# EAGLE board robot_board (EAGLE 7.2.0), part 1 of 2
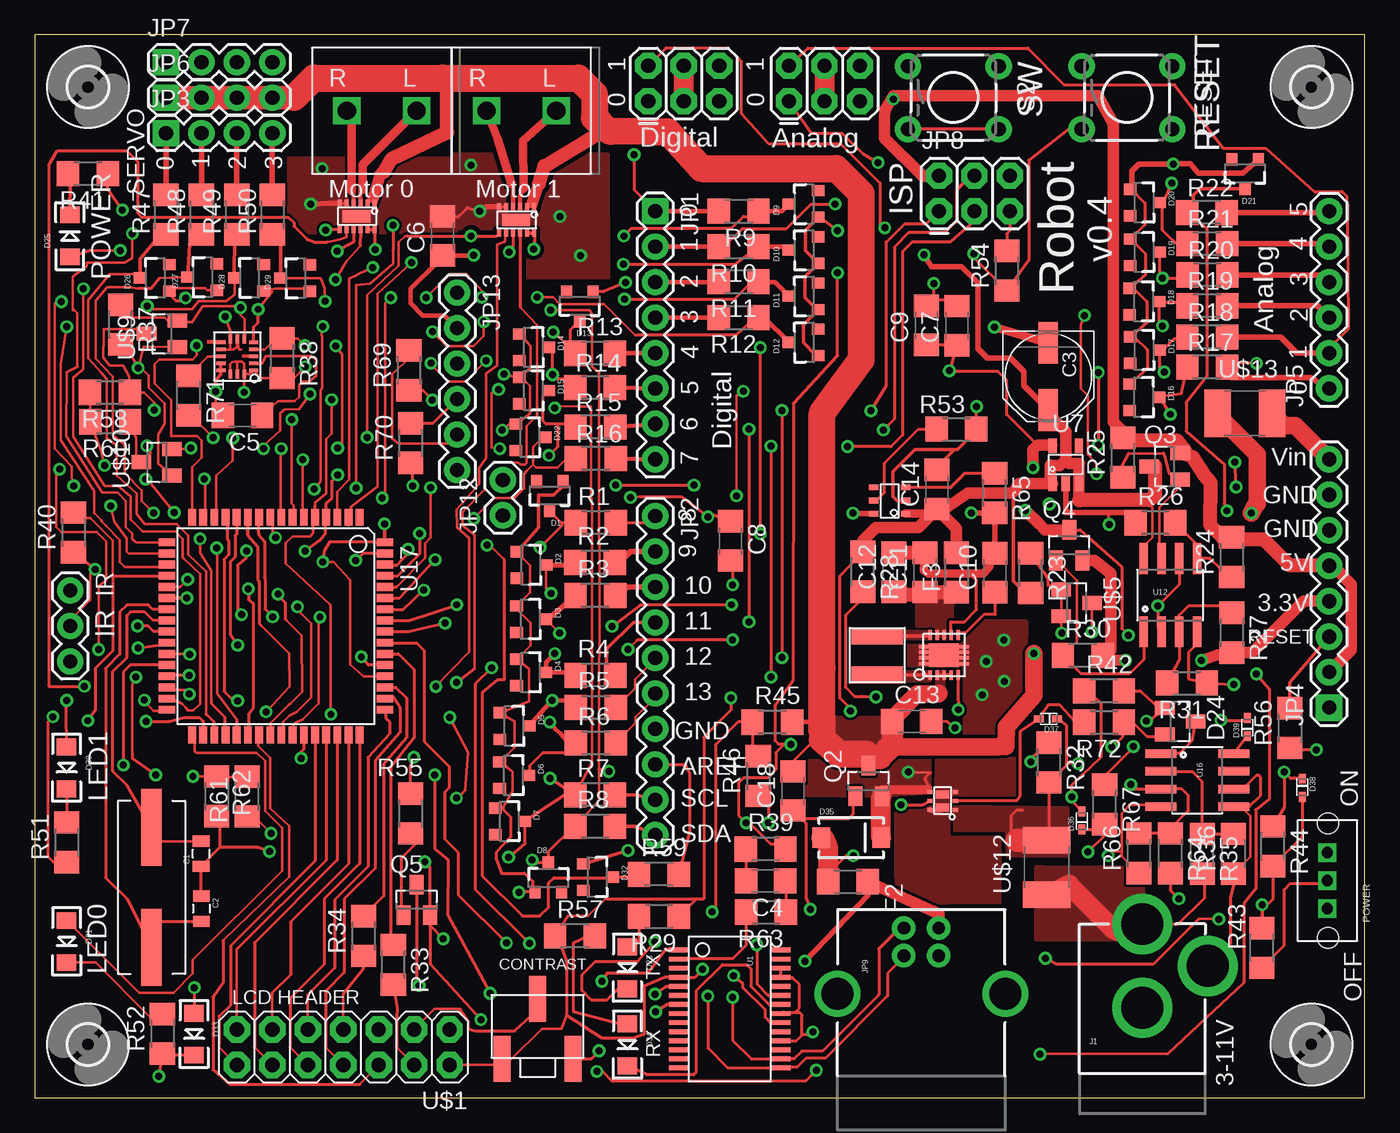
[diagram p1: board, top side]
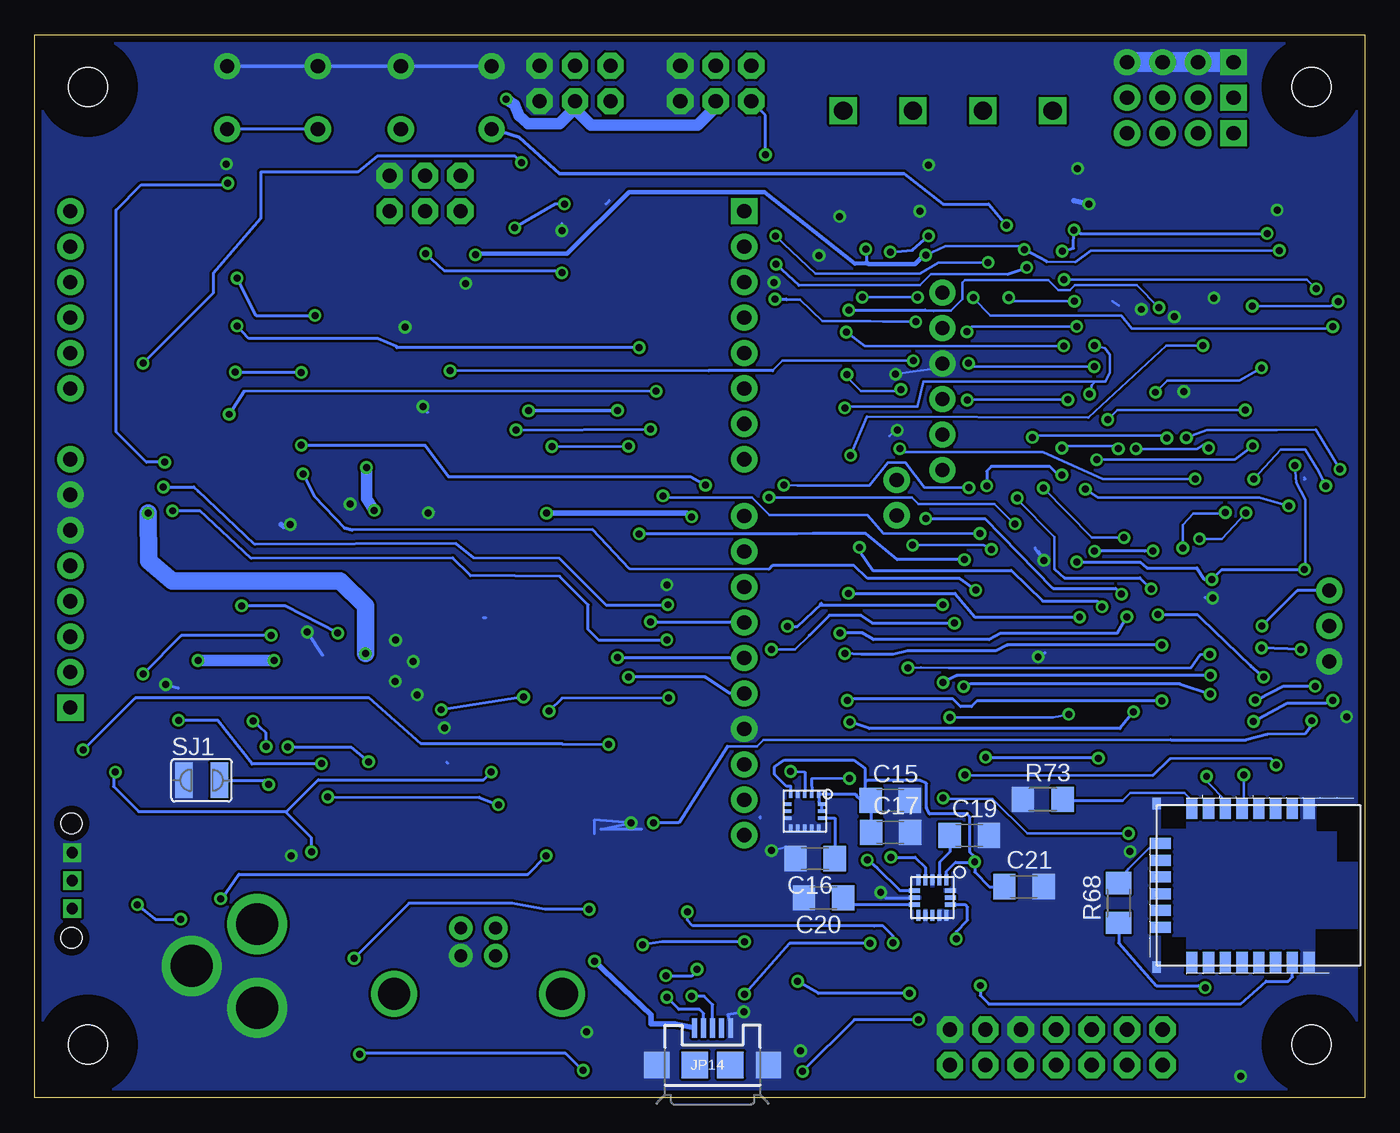
[diagram p2: board, bottom side, seen from below]

Size 95.24 x 76.12 mm. Coordinates in mm from the lower left corner, seen from the top.
Outline: 95.24,0 95.24,76.12 0,76.12 0,0 95.24,0
Copper layers (1*16): Top 0.035mm / dielectric 1.5mm / Bottom 0.035mm
Design rules "default *": minimum track width 7mil, minimum drill 19mil, track to track 7mil, track to pad 8mil, pad to pad 8mil, via to via 8mil, smd to smd 1mil, copper to edge 20mil, drill to drill 8mil, minimum pad ring 10mil, minimum via ring 8mil, stop-mask expansion 4mil, vias tented up to drill 0mil, thermal gap 10mil
bRestrict: area 0.3,16.9 to 1.9,19.1; area 0.3,19.1 to 3.4,21; area 0.2,9.4 to 3.5,12; area 12.8,19.3 to 14.5,21; area 12.8,9.4 to 14.5,11.4; area 30.2,13.6 to 31.7,15

## Footprints (pad centres in the part's own frame; a part is rotated, then mirrored left to right if it is on the bottom)
0805 = smd 0.8 x 1.2: 1 -0.9,0; 2 0.9,0
PANASONIC_D = smd 3 x 1.4: + 2.4,0; - -2.4,0
C1206 = smd 1.6 x 1.8: 1 -1.4,0; 2 1.4,0
SOT23-3 = smd 0.8 x 0.9: 1 -0.95,-1; 2 0.95,-1; 3 0,1.1
LED-1206 = smd 1.2 x 1.4: A -1.5,0; C 1.5,0
SOT23 = smd 1 x 1.4: 1 -0.95,-1.1; 2 0.95,-1.1; 3 0,1.1
SMA-DIODE = smd 1.27 x 1.47: A -2.15,0; C 2.15,0
SOD523 = smd 0.7 x 0.5: A 0.7,0; C -0.6,0
R1206 = smd 1.6 x 1.803: 1 -1.422,0; 2 1.422,0
2,8 = hole 2.8: 0,0
1X03 = drill 1.016 pad 1.88: 1 0,0; 2 2.54,0; 3 5.08,0
POWER_JACK_PTH = drill 2.997 pad 4.318: GND 0,7.7; GNDBREAK 4.7,10.7; PWR 0,13.7
1X08 = drill 1.016 pad 1.88 square: 1 0,0 | drill 1.016 pad 1.88: 2 2.54,0; 3 5.08,0; 4 7.62,0; 5 10.16,0; 6 12.7,0; 7 15.24,0; 8 17.78,0
1X10 = drill 1.016 pad 1.88: 1 0,0; 2 2.54,0; 3 5.08,0; 4 7.62,0; 5 10.16,0; 6 12.7,0; 7 15.24,0; 8 17.78,0; 9 20.32,0; 10 22.86,0
1X04 = drill 1.016 pad 1.88 square: 1 0,0 | drill 1.016 pad 1.88: 2 2.54,0; 3 5.08,0; 4 7.62,0
1X06 = drill 1.016 pad 1.88: 1 0,0; 2 2.54,0; 3 5.08,0; 4 7.62,0; 5 10.16,0; 6 12.7,0
2X3 = drill 1.016 pad 1.88 octagon: 1 0,0; 2 0,2.54; 3 2.54,0; 4 2.54,2.54; 5 5.08,0; 6 5.08,2.54
USB-B-PTH = drill 0.914 pad 1.676: D+ 0,1.25; D- 1.981,1.25; GND 0,-1.25; VBUS 1.981,-1.25 | drill 2.286: S1 -2.718,-6.02; S2 -2.718,6.02
1X02 = drill 1.016 pad 1.88: 1 0,0; 2 2.54,0
USB-MICROB = smd 0.35 x 1.4: D+ 0,2.65; D- -0.65,2.65; GND 1.3,2.65; ID 0.65,2.65; VBUS -1.3,2.65 | smd 1.8 x 1.9: MT1 -4,0; MT2 4,0 | smd 1.9 x 1.9: P$1 -1.27,0; P$2 1.27,0
SW = drill 0.8 square: P$1 0,0; P$2 2,0; P$3 -2,0 | hole 1.5: -4.1,-0.04; 4.1,-0.04
TACTILE-PTH = drill 1.016 pad 1.88: 1 -3.251,2.261; 2 3.251,2.261; 3 -3.251,-2.261; 4 3.251,-2.261
SJW = smd 1.27 x 2.54: 1 -1.27,0; 2 1.27,0
SSOP28DB = smd 0.348 x 1.397: 1 -4.225,-3.656; 2 -3.575,-3.656; 3 -2.925,-3.656; 4 -2.275,-3.656; 5 -1.625,-3.656; 6 -0.975,-3.656; 7 -0.325,-3.656; 8 0.325,-3.656; 9 0.975,-3.656; 10 1.625,-3.656; 11 2.275,-3.656; 12 2.925,-3.656; 13 3.575,-3.656; 14 4.225,-3.656; 15 4.225,3.656; 16 3.575,3.656; 17 2.925,3.656; 18 2.275,3.656; 19 1.625,3.656; 20 0.975,3.656; 21 0.325,3.656; 22 -0.325,3.656; 23 -0.975,3.656; 24 -1.625,3.656; 25 -2.275,3.656; 26 -2.925,3.656; 27 -3.575,3.656; 28 -4.225,3.656
SOT-23-5 = smd 1.05 x 0.6: P$1 0.53,2.24; P$2 0.53,1.29; P$3 0.53,0.34; P$4 3.23,2.24; P$5 3.23,0.35
SOT23-M5 = smd 0.4 x 0.7: P$1 -0.62,-0.35; P$2 0.33,-0.35; P$3 1.28,-0.35; P$4 1.28,1.94; P$5 0.33,1.94; P$6 -0.62,1.94
PWSON-N12 = smd 2 x 0.9: GND 0.82,0.63 | smd 0.28 x 0.5: P$1 -0.46,-0.32; P$2 0.04,-0.32; P$3 0.54,-0.32; P$4 1.04,-0.32; P$5 1.54,-0.32; P$6 2.04,-0.32; P$7 -0.46,1.58; P$8 0.04,1.58; P$9 0.54,1.58; P$10 1.04,1.58; P$11 1.54,1.58; P$12 2.04,1.58
SO08 = smd 0.61 x 2.21: 1 -1.905,-2.616; 2 -0.635,-2.616; 3 0.635,-2.616; 4 1.905,-2.616; 5 1.905,2.616; 6 0.635,2.616; 7 -0.635,2.616; 8 -1.905,2.616
TQFP64 = smd 1.194 x 0.559: 1 -7.8,6; 2 -7.8,5.2; 3 -7.8,4.4; 4 -7.8,3.6; 5 -7.8,2.8; 6 -7.8,2; 7 -7.8,1.2; 8 -7.8,0.4; 9 -7.8,-0.4; 10 -7.8,-1.2; 11 -7.8,-2; 12 -7.8,-2.8; 13 -7.8,-3.6; 14 -7.8,-4.4; 15 -7.8,-5.2; 16 -7.8,-6; 33 7.8,-6; 34 7.8,-5.2; 35 7.8,-4.4; 36 7.8,-3.6; 37 7.8,-2.8; 38 7.8,-2; 39 7.8,-1.2; 40 7.8,-0.4; 41 7.8,0.4; 42 7.8,1.2; 43 7.8,2; 44 7.8,2.8; 45 7.8,3.6; 46 7.8,4.4; 47 7.8,5.2; 48 7.8,6 | smd 0.559 x 1.194: 17 -6,-7.8; 18 -5.2,-7.8; 19 -4.4,-7.8; 20 -3.6,-7.8; 21 -2.8,-7.8; 22 -2,-7.8; 23 -1.2,-7.8; 24 -0.4,-7.8; 25 0.4,-7.8; 26 1.2,-7.8; 27 2,-7.8; 28 2.8,-7.8; 29 3.6,-7.8; 30 4.4,-7.8; 31 5.2,-7.8; 32 6,-7.8; 49 6,7.8; 50 5.2,7.8; 51 4.4,7.8; 52 3.6,7.8; 53 2.8,7.8; 54 2,7.8; 55 1.2,7.8; 56 0.4,7.8; 57 -0.4,7.8; 58 -1.2,7.8; 59 -2,7.8; 60 -2.8,7.8; 61 -3.6,7.8; 62 -4.4,7.8; 63 -5.2,7.8; 64 -6,7.8
2X7 = drill 1.016 pad 1.88 octagon: 1 0,0; 2 0,2.54; 3 2.54,0; 4 2.54,2.54; 5 5.08,0; 6 5.08,2.54; 7 7.62,0; 8 7.62,2.54; 9 10.16,0; 10 10.16,2.54; 11 12.7,0; 12 12.7,2.54; 13 15.24,0; 14 15.24,2.54
POT = smd 1.194 x 3.302: 1 -2.54,0; 2 0,4.318; 3 2.54,0
WSON-10 = smd 0.7 x 0.25: GND@N1 -1.43,0.6; GND@N2 -1.43,0.2; GND@N3 -1.43,-0.2; GND@N4 -1.43,-0.6; GND@N5 1.43,0.6; GND@N6 1.43,0.2; GND@N7 1.43,-0.2; GND@N8 1.43,-0.6 | smd 0.25 x 0.7: P$1 -1,-1.44; P$2 -0.5,-1.44; P$3 0,-1.44; P$4 0.5,-1.44; P$5 1,-1.43; P$6 1,1.44; P$7 0.5,1.44; P$8 0,1.44; P$9 -0.5,1.44; P$10 -1,1.44 | smd 2.16 x 1.7: P$11 0,0
TAIYO4012 = smd 1.2 x 3.7: P$1 1.4,0; P$2 -1.4,0
SC70T = smd 0.3 x 0.35: D1@1 -0.65,0.89; D2@1 0.65,-0.94; G1 0,-0.94; G2 0,0.89; S1 -0.65,-0.94; S2 0.65,0.89 | smd 0.6 x 0.95: D1@2 -0.47,-0.02; D2@2 0.46,-0.02
RN4020_PKG = smd 1.5 x 0.8: P$1 0.25,10.9; P$2 0.25,9.7; P$3 0.25,8.5; P$4 0.25,7.3; P$5 0.25,6.1; P$6 0.25,4.9; P$7 0.25,3.7; P$8 0.25,2.5; P$15 11.25,2.5; P$16 11.25,3.7; P$17 11.25,4.9; P$18 11.25,6.1; P$19 11.25,7.3; P$20 11.25,8.5; P$21 11.25,9.7; P$22 11.25,10.9 | smd 0.8 x 1.5: P$9 2.75,0.25; P$10 3.95,0.25; P$11 5.15,0.25; P$12 6.35,0.25; P$13 7.55,0.25; P$14 8.75,0.25 | smd 0.8 x 0.635: P$23 -0.1,-0.02; P$24 11.6,-0.02
QFN-COL = smd 0.67 x 0.25: P$1 -1.17,0.99; P$2 -1.17,0.49; P$3 -1.17,-0.01; P$4 -1.17,-0.51; P$5 -1.17,-1.01; P$9 1.17,-1; P$10 1.17,-0.5; P$11 1.17,0; P$12 1.17,0.5; P$13 1.17,1 | smd 0.25 x 0.67: P$6 -0.5,-1.26; P$7 0,-1.26; P$8 0.5,-1.26; P$14 0.5,1.26; P$15 0,1.26; P$16 -0.5,1.26
LGA-16 = smd 0.5 x 0.25: P$1 -1.19,1; P$2 -1.19,0.5; P$3 -1.19,0; P$4 -1.19,-0.5; P$5 -1.19,-1; P$9 1.19,-1; P$10 1.19,-0.5; P$11 1.19,0; P$12 1.19,0.5; P$13 1.19,1 | smd 0.25 x 0.5: P$6 -0.5,-1.19; P$7 0,-1.19; P$8 0.5,-1.19; P$14 0.5,1.19; P$15 0,1.19; P$16 -0.5,1.19
C1812 = smd 1.9 x 3.4: 1 -1.95,0; 2 1.95,0
FSOS8700CQ_PKG = smd 0.8 x 0.3: P$1 -1.28,1; P$2 -1.28,0.5; P$3 -1.28,0; P$4 -1.28,-0.5; P$5 -1.28,-1; P$9 1.28,-1; P$10 1.28,-0.5; P$11 1.28,0; P$12 1.28,0.5; P$13 1.28,1 | smd 0.3 x 0.8: P$6 -0.5,-1.28; P$7 0,-1.28; P$8 0.5,-1.28; P$14 0.5,1.28; P$15 0,1.28; P$16 -0.5,1.28
2POS_TERMINAL = drill 1.3 square: L -5,0; R 0,0
CRYSTAL-SMD-10.5X4.8-2PIN = smd 5.5 x 1.5: P$1 -4.3,0; P$2 4.3,0

## Placement (x,y rotation side)
C1  22pF  [0805]  11.9,17.48 90 top
C2  22pF  [0805]  11.93,13.54 270 top
C3  100uF  [PANASONIC_D]  72.58,51.66 270 top
C4  .1uF  [C1206]  52.34,15.52 180 top
C5  .1uF  [C1206]  14.87,48.87 180 top
C6  .1uF  [C1206]  29.2,61.72 90 top
C7  22uF  [C1206]  66.03,55.3 90 top
C8  .1uF  [C1206]  49.82,39.88 270 top
C9  1uF  [C1206]  63.85,55.32 90 top
C10  .1uF  [C1206]  68.75,37.59 90 top
C11  22uF  [C1206]  63.74,37.62 90 top
C12  22uF  [C1206]  61.53,37.64 90 top
C13  22uF  [C1206]  62.8,26.95 0 top
C14  1uF  [C1206]  64.61,43.56 90 top
C15  .1uF  [C1206]  33.98,21.29 0 bottom
C16  .01uF (25V)  [C1206]  39.36,17.12 180 bottom
C17  10uF  [C1206]  33.95,19 0 bottom
C18  .1uF  [C1206]  54.3,21.97 90 top
C19  .1uF  [C1206]  28.31,18.8 0 bottom
C20  .1uF  [C1206]  38.75,14.3 180 bottom
C21  .1uF  [C1206]  24.4,15.11 0 bottom
D1  5.1V  [SOT23-3]  36.87,43.13 180 top
D2  5.1V  [SOT23-3]  35.52,38.15 270 top
D3  5.1V  [SOT23-3]  35.5,34.26 270 top
D4  5.1V  [SOT23-3]  35.5,30.45 270 top
D5  5.1V  [SOT23-3]  34.31,26.62 270 top
D6  5.1V  [SOT23-3]  34.28,23.09 270 top
D7  3.6V  [SOT23-3]  33.98,19.79 270 top
D8  3.6V  [SOT23-3]  36.77,15.72 0 top
D9  5.1V  [SOT23-3]  55.11,64.01 90 top
D10  5.1V  [SOT23-3]  55.11,60.71 90 top
D11  5.1V  [SOT23-3]  55.11,57.4 90 top
D12  5.1V  [SOT23-3]  55.11,54.1 90 top
D13  5.1V  [SOT23-3]  39.03,56.72 180 top
D14  5.1V  [SOT23-3]  35.7,53.75 270 top
D15  5.1V  [SOT23-3]  35.7,50.65 270 top
D16  5.1V  [SOT23-3]  79.42,50.16 270 top
D17  5.1V  [SOT23-3]  79.44,53.54 270 top
D18  5.1V  [SOT23-3]  79.42,57.02 270 top
D19  5.1V  [SOT23-3]  79.44,60.55 270 top
D20  5.1V  [SOT23-3]  79.44,64.11 270 top
D21  5.1V  [SOT23-3]  86.68,66.19 180 top
D22  5.1V  [SOT23-3]  35.45,47.29 270 top
D23  YELLOW  [LED-1206]  42.43,9.3 270 top
D24  BAT54C  [SOT23]  82.03,26.95 270 top
D25  RED  [LED-1206]  2.5,61.72 90 top
D26  5.1V  [SOT23-3]  8.63,58.72 90 top
D27  5.1V  [SOT23-3]  12.03,58.78 90 top
D28  5.1V  [SOT23-3]  15.38,58.72 90 top
D29  5.1V  [SOT23-3]  18.68,58.7 90 top
D30  GREEN  [LED-1206]  2.28,23.62 270 top
D31  YELLOW  [LED-1206]  2.28,11.18 270 top
D32  5.1V  [SOT23-3]  40.27,15.8 270 top
D33  YELLOW  [LED-1206]  11.39,4.55 270 top
D34  YELLOW  [LED-1206]  42.43,3.78 270 top
D35  STPS2L40U  [SMA-DIODE]  58.46,18.62 0 top
D36  BZX584C10-V-G-08  [SOD523]  75,19.81 90 top
D37  BZX584C10-V-G-08  [SOD523]  72.61,27.13 180 top
D38  BZX584C10-V-G-08  [SOD523]  90.77,22.25 270 top
D39  RB751S40T1G  [SOD523]  86.83,26.49 90 top
F2  1206PPTC_FUSE  [R1206]  58.23,15.47 180 top
F3  1206PPTC_FUSE  [R1206]  66,37.62 90 top
H1  MOUNT-HOLE2.8  [2,8]  3.8,3.81 90 top
H2  MOUNT-HOLE2.8  [2,8]  3.8,72.39 90 top
H3  MOUNT-HOLE2.8  [2,8]  91.43,3.81 90 top
H4  MOUNT-HOLE2.8  [2,8]  91.43,72.39 90 top
IR  [1X03]  2.53,36.32 270 top
J1  POWER_JACKPTH  [POWER_JACK_PTH]  79.31,-1.27 0 top
JP1  [1X08]  44.44,63.5 270 top
JP2  M10"  [1X10]  44.44,41.66 270 top
JP3  [1X04]  9.39,69.09 0 top
JP4  [1X08]  92.7,27.94 90 top
JP5  [1X06]  92.7,50.8 90 top
JP6  [1X04]  9.39,71.63 0 top
JP7  [1X04]  9.39,74.17 0 top
JP8  [2X3]  64.76,63.5 0 top
JP9  USB-B  [USB-B-PTH]  63.49,10.16 90 top
JP10  [2X3]  54.02,71.37 0 top
JP11  [2X3]  43.93,71.37 0 top
JP12  M02PTH  [1X02]  33.52,41.71 90 top
JP13  Bluesmirf  [1X06]  30.24,57.66 270 top
JP14  USB-MICROB  [USB-MICROB]  46.7,2.34 0 bottom
POWER  SW  [SW]  92.57,15.54 90 top
Q2  SSM3J332R  [SOT23]  59.71,22.68 0 top
Q3  IRLML6402  [SOT23]  80.91,45.21 90 top
Q4  IRLML6402  [SOT23]  74.08,39.57 0 top
Q5  IRLML6402  [SOT23]  27.35,14.17 0 top
R1  300  [R1206]  40.17,41.17 0 top
R2  300  [R1206]  40.12,38.33 0 top
R3  300  [R1206]  40.15,35.97 0 top
R4  300  [R1206]  40.15,30.25 0 top
R5  300  [R1206]  40.17,27.94 0 top
R6  300  [R1206]  40.17,25.4 0 top
R7  300  [R1206]  40.12,21.69 0 top
R8  300  [R1206]  40.12,19.43 0 top
R9  300  [R1206]  50.41,63.5 180 top
R10  300  [R1206]  50.41,60.96 180 top
R11  300  [R1206]  50.41,58.45 180 top
R12  300  [R1206]  50.41,55.88 180 top
R13  300  [R1206]  40.12,53.31 0 top
R14  300  [R1206]  40.12,50.85 0 top
R15  300  [R1206]  40.15,48.03 0 top
R16  300  [R1206]  40.17,45.77 0 top
R17  300  [R1206]  83.96,52.32 0 top
R18  300  [R1206]  83.96,54.48 0 top
R19  300  [R1206]  83.96,56.72 0 top
R20  300  [R1206]  83.99,58.93 0 top
R21  300  [R1206]  83.96,61.16 0 top
R22  300  [R1206]  83.94,63.4 0 top
R23  1K 1%  [R1206]  71.31,37.57 270 top
R24  24K 1%  [R1206]  85.71,38.71 90 top
R25  20K 1%  [R1206]  77.92,45.85 90 top
R26  20K 1%  [R1206]  80.25,41.17 0 top
R27  10K 1%  [R1206]  85.74,33.3 270 top
R28  1M  [R1206]  59.3,37.67 270 top
R29  330  [R1206]  44.69,12.98 180 top
R30  20K 1%  [R1206]  75.05,31.67 0 top
R31  24K 1%  [R1206]  82.51,29.69 180 top
R32  10K 1%  [R1206]  72.63,24 270 top
R33  300  [R1206]  25.67,9.53 270 top
R34  300  [R1206]  23.54,11.58 90 top
R35  100K 1%  [R1206]  83.61,17.48 270 top
R36  10K 1%  [R1206]  85.84,17.48 90 top
R37  10K 1%  [R1206]  6.14,55.37 270 top
R38  10K 1%  [R1206]  17.72,52.96 270 top
R39  1K 1%  [R1206]  52.34,17.81 0 top
R40  10K 1%  [R1206]  2.76,40.49 90 top
R41  560  [R1206]  3.8,66.19 180 top
R42  560  [R1206]  76.57,29.13 0 top
R43  4.7K 1%  [R1206]  87.87,10.72 270 top
R44  100K 1%  [R1206]  88.66,18.01 270 top
R45  120K 1%  [R1206]  52.82,26.9 0 top
R46  100K 1%  [R1206]  51.81,23.04 90 top
R47  300  [R1206]  9.39,63.25 90 top
R48  300  [R1206]  11.93,63.25 90 top
R49  300  [R1206]  14.47,63.25 90 top
R50  300  [R1206]  17.01,63.25 90 top
R51  330  [R1206]  2.28,18.29 90 top
R52  330  [R1206]  9.13,4.57 90 top
R53  1.5K 1%  [R1206]  66,47.88 180 top
R54  1K 1%  [R1206]  69.61,59.23 90 top
R55  1K 1%  [R1206]  26.91,20.35 90 top
R56  1K 1%  [R1206]  89.88,26.47 90 top
R57  330  [R1206]  38.67,11.58 0 top
R58  10K 1%  [R1206]  5.37,50.52 180 top
R59  1K 1%  [R1206]  44.69,16 0 top
R60  10K 1%  [R1206]  5.4,48.41 180 top
R61  1K 1%  [R1206]  15.2,21.56 270 top
R62  2K  [R1206]  13.02,21.59 90 top
R63  300  [R1206]  52.36,13.28 180 top
R64  120K 1%  [R1206]  81.32,17.5 270 top
R65  1K 1%  [R1206]  68.75,43.31 270 top
R66  120K 1%  [R1206]  79.06,17.5 90 top
R67  10K 1%  [R1206]  76.62,21.01 270 top
R68  300  [R1206]  17.62,13.94 90 bottom
R69  300  [R1206]  26.79,52.1 90 top
R70  300  [R1206]  26.91,46.89 90 top
R71  1K 1%  [R1206]  11.01,50.29 270 top
R72  560  [R1206]  76.57,26.9 180 top
R73  1K 1%  [R1206]  23.05,21.36 0 bottom
RESET  [TACTILE-PTH]  78.22,71.63 0 top
S2  [TACTILE-PTH]  65.78,71.63 0 top
SJ1  [SJW]  83.3,22.73 0 bottom
U1  FT232RL-BASICSSOP  [SSOP28DB]  49.77,6.35 270 top
U7  TLV70233  [SOT-23-5]  75.12,43.46 90 top
U8  MIC2009A  [SOT23-M5]  62.02,42.44 90 top
U9  DRV8839  [PWSON-N12]  35.3,63.5 180 top
U10  DRV8839  [PWSON-N12]  23.87,63.75 180 top
U12  LM393  [SO08]  81.32,35.99 0 top
U16  LM393  [SO08]  83.25,22.73 270 top
U17  ATMEGA325PA  [TQFP64]  17.26,33.78 270 top
U$1  2X7HEADER  [2X7]  29.71,4.88 180 top
U$2  POT  [POT]  36.01,2.77 0 top
U$3  TPS63061  [WSON-10]  65.12,31.7 0 top
U$4  1uH  [TAIYO4012]  60.34,31.67 270 top
U$5  AP431SAG-7  [SOT23]  74.62,35.43 270 top
U$6  SIA907EDJT  [SC70T]  64.99,21.26 90 top
U$7  RN4020  [RN4020_PKG]  14.87,20.95 270 bottom
U$8  MMA8453Q  [QFN-COL]  14.49,53.09 180 top
U$9  BSS138  [SOT23]  9.11,54.71 90 top
U$10  BSS138  [SOT23]  8.73,45.52 90 top
U$11  L3GD20HTR  [LGA-16]  40.1,20.52 270 bottom
U$12  PTS181224V150  [C1812]  72.46,16.48 90 top
U$13  PTS181224V150  [C1812]  86.65,49.02 0 top
U$14  FXOS8700CQ  [FSOS8700CQ_PKG]  30.95,14.33 270 bottom
U$19  2POS_TERMINAL  [2POS_TERMINAL]  32.35,70.69 180 top
U$20  2POS_TERMINAL  [2POS_TERMINAL]  22.34,70.69 180 top
Y1  20MHz  [CRYSTAL-SMD-10.5X4.8-2PIN]  8.35,15.06 270 top